# Altium project AOT_Board.PrjPcb
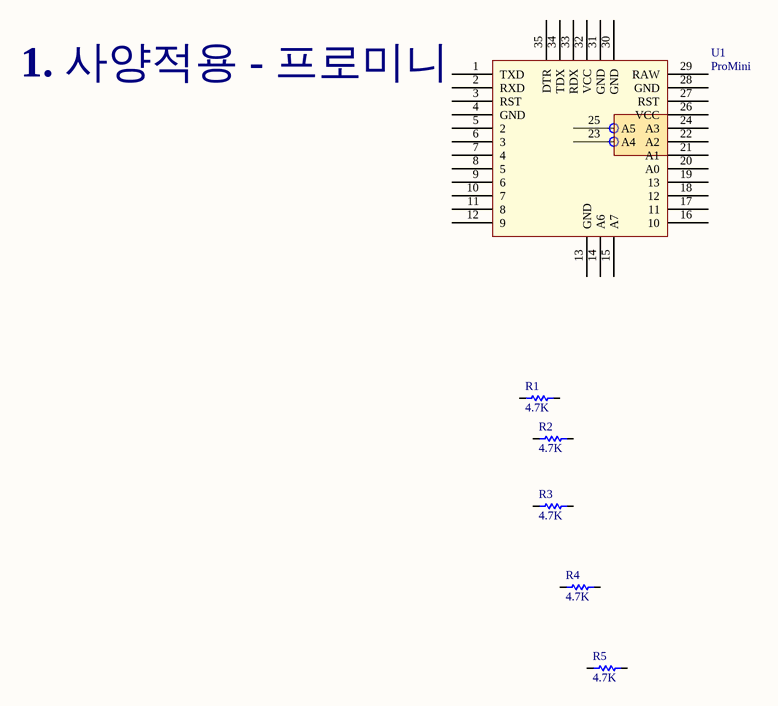
[diagram p0: AOT_Board.SchDoc]
1 sheet, 6 parts. Net scope: global (net labels, ports and power ports of the same name join across sheets).
Board file: AOT_Board.PcbDoc

## Sheet AOT_Board.SchDoc
size A4; SheetNumber: 1; SheetTotal: 1

### Parts
R1  4.7K  [0603R1608]
R2  4.7K  [0603R1608]
R3  4.7K  [0603R1608]
R4  4.7K  [0603R1608]
R5  4.7K  [0603R1608]
U1  ProMini  [Pro_Mini_smd]

### Nets

Not connected (* = marked no-connect by the designer): R1 1 2; R2 1 2; R3 1 2; R4 1 2; R5 1 2; U1 1(TXD) 2(RXD) 3(RST) 4(GND) 5(2) 6(3) 7(4) 8(5) 9(6) 10(7) 11(8) 12(9) 13(GND) 14(A6) 15(A7) 16(10) 17(11) 18(12) 19(13) 20(A0) 21(A1) 22(A2) 23(A4) 24(A3) 25(A5) 26(VCC) 27(RST) 28(GND) 29(RAW) 30(GND) 31(GND) 32(VCC) 33(RDX) 34(TDX) 35(DTR)

### Notes on the sheet
- 1. 사양적용 - 프로미니

### Library data of the parts
R1-R5 = Res1: Resistor; Published: 8-Jun-2000; LatestRevisionDate: 17-Jul-2002; LatestRevisionNote: Re-released for DXP Platform.; PackageReference: AXIAL-0.3; Publisher: Altium Limited; PackageDescription: Axial Device, Thru-Hole; 2 Leads; 0.3 in Pin Spacing
U1 = Pro-Mini